# Altium schematic sheet MCU.SchDoc: MCU Schematic
size A4; Date: 25 July 2024; Author: Ibrahim Oladepo; DrawnBy: Ibrahim Oladepo; SheetNumber: 2; SheetTotal: 5
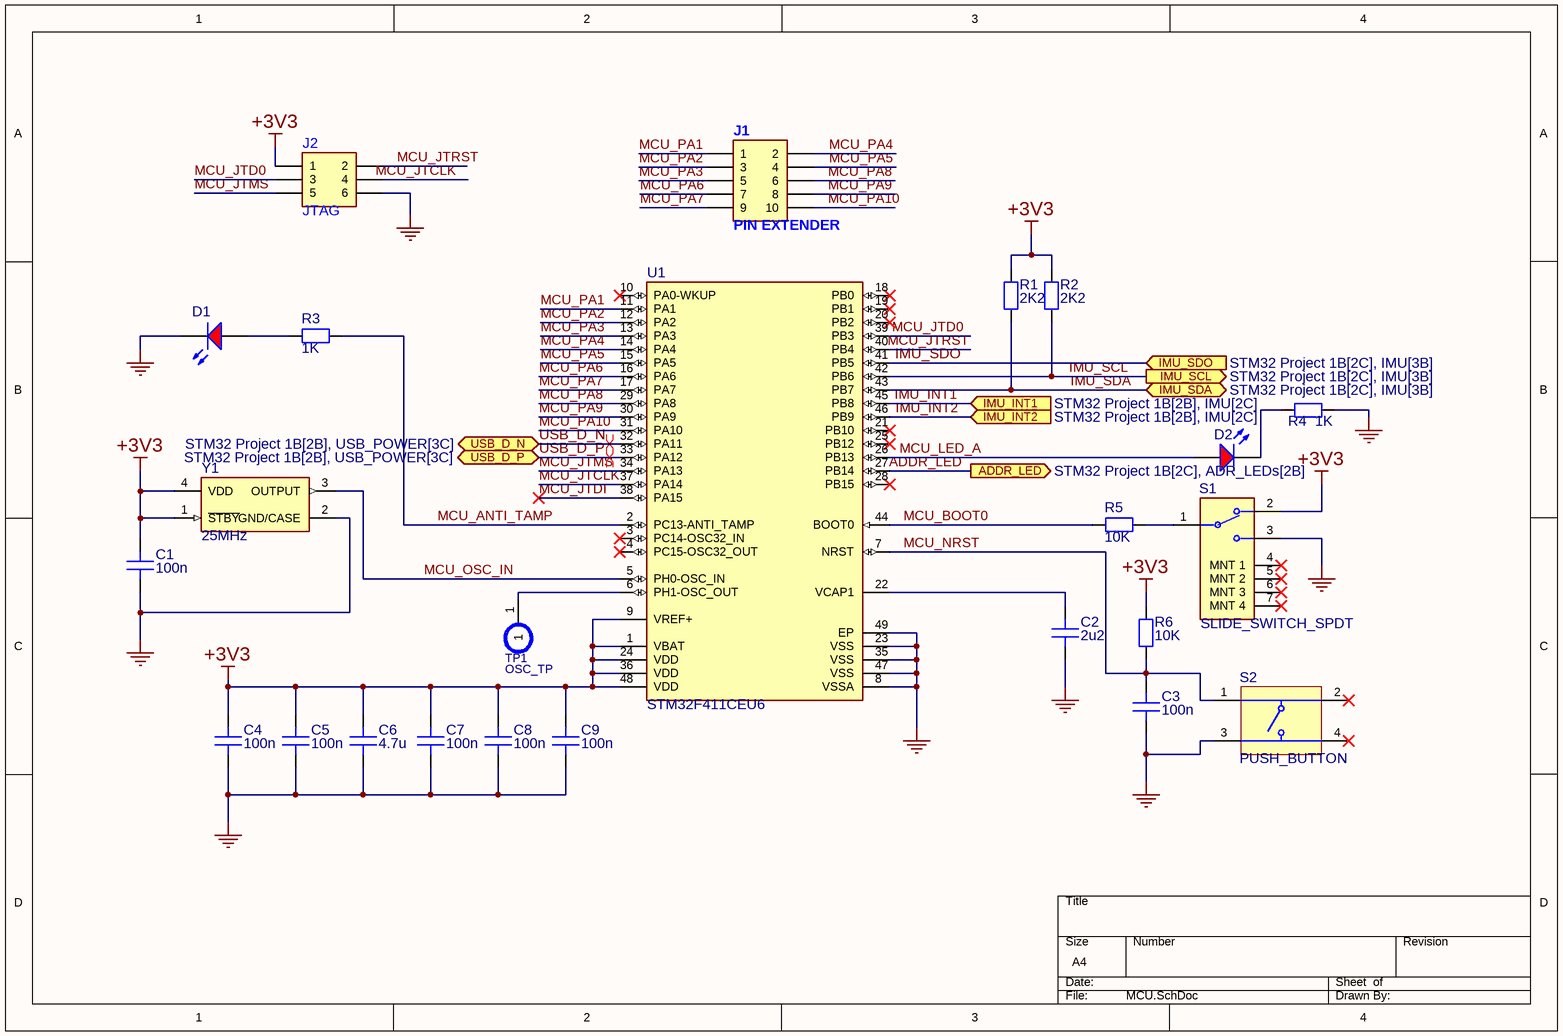
[diagram p0: MCU.SchDoc]

## Parts
C1  100n  [CAP_0805]
C2  2u2  [CAP_0805]
C3  100n  [CAP_0805]
C4  100n  [CAP_0805]
C5  100n  [CAP_0805]
C6  4.7u  [CAP_0805]
C7  100n  [CAP_0805]
C8  100n  [CAP_0805]
C9  100n  [CAP_0805]
D1  LED_RED_0805  [LED_RED_0805]  (value not drawn)
D2  LED_RED_0805  [LED_RED_0805]  (value not drawn)
J1  PIN EXTENDER  [10P_2x5_HEADER]
J2  JTAG  [6P_2x3_HEADER]
R1  2K2  [RES_0805]
R2  2K2  [RES_0805]
R3  1K  [RES_0805]
R4  1K  [RES_0805]
R5  10K  [RES_0805]
R6  10K  [RES_0805]
S1  SLIDE_SWITCH_SPDT  [SLIDE_SWITCH_SPDT]
S2  PUSH_BUTTON  [PUSH_BUTTON]
TP1  OSC_TP  [TEST_POINT_SMD]  (no BOM)
U1  STM32F411CEU6  [STM32F411CEU6]
Y1  25MHz  [XTAL_OSCILLATOR_25MHz]

## Ports
ADDR_LED (out, see STM32 Project 1B[2C], ADR_LEDs[2B]), IMU_INT1 (in, see STM32 Project 1B[2B], IMU[2C]), IMU_INT2 (in, see STM32 Project 1B[2B], IMU[2C]), IMU_SCL (out, see STM32 Project 1B[2C], IMU[3B]), IMU_SDA (bidir, see STM32 Project 1B[2C], IMU[3B]), IMU_SDO (in, see STM32 Project 1B[2C], IMU[3B]), USB_D_N (bidir, see STM32 Project 1B[2B], USB_POWER[3C]), USB_D_P (bidir, see STM32 Project 1B[2B], USB_POWER[3C])

## Nets
+3V3: C1.2 C4.2 C5.2 C6.2 C7.2 C8.2 C9.2 J2.1 R1.1 R2.1 R6.1 S1.2 U1.1(VBAT) U1.9(VREF+) U1.24(VDD) U1.36(VDD) U1.48(VDD) Y1.1(~{STBY}) Y1.4(VDD)
GND: C1.1 C2.1 C3.1 C4.1 C5.1 C6.1 C7.1 C8.1 C9.1 D1.1(K) J2.6 R4.1 S1.3 S2.3 U1.8(VSSA) U1.23(VSS) U1.35(VSS) U1.47(VSS) U1.49(EP) Y1.2(GND/CASE)
ADDR_LED: U1.27(PB14) ; port ADDR_LED
IMU_INT1: U1.45(PB8) ; port IMU_INT1
IMU_INT2: U1.46(PB9) ; port IMU_INT2
IMU_SCL: R2.2 U1.42(PB6) ; port IMU_SCL
IMU_SDA: R1.2 U1.43(PB7) ; port IMU_SDA
IMU_SDO: U1.41(PB5) ; port IMU_SDO
MCU_ANTI_TAMP: R3.1 U1.2(PC13-ANTI_TAMP)
MCU_BOOT0: R5.2 U1.44(BOOT0)
MCU_JTCLK: J2.4 U1.37(PA14)
MCU_JTD0: J2.3 U1.39(PB3)
MCU_JTDI: U1.38(PA15)
MCU_JTMS: J2.5 U1.34(PA13)
MCU_JTRST: J2.2 U1.40(PB4)
MCU_LED_A: D2.2(A) U1.26(PB13)
MCU_NRST: C3.2 R6.2 S2.1 U1.7(NRST)
MCU_OSC_IN: U1.5(PH0-OSC_IN) Y1.3(OUTPUT)
MCU_PA1: J1.1 U1.11(PA1)
MCU_PA2: J1.3 U1.12(PA2)
MCU_PA3: J1.5 U1.13(PA3)
MCU_PA4: J1.2 U1.14(PA4)
MCU_PA5: J1.4 U1.15(PA5)
MCU_PA6: J1.7 U1.16(PA6)
MCU_PA7: J1.9 U1.17(PA7)
MCU_PA8: J1.6 U1.29(PA8)
MCU_PA9: J1.8 U1.30(PA9)
MCU_PA10: J1.10 U1.31(PA10)
USB_D_N: U1.32(PA11) ; port USB_D_N
USB_D_P: U1.33(PA12) ; port USB_D_P
NetC2_2: C2.2 U1.22(VCAP1)
NetD1_2: D1.2(A) R3.2
NetD2_1: D2.1(K) R4.2
NetR5_1: R5.1 S1.1
NetTP1_1: TP1.1 U1.6(PH1-OSC_OUT)

Not connected (* = marked no-connect by the designer): S1 4(MNT_1)* 5(MNT_2)* 6(MNT_3)* 7(MNT_4)*; S2 2* 4*; U1 3(PC14-OSC32_IN)* 4(PC15-OSC32_OUT)* 10(PA0-WKUP)* 18(PB0)* 19(PB1)* 20(PB2)* 21(PB10)* 25(PB12)* 28(PB15)*

## Layout directives
differential pair: USB_D_N, USB_D_P

## Library data of the parts
C1-C9 = CAP_0805: Capacitor SMD 0805 Generic; Manufacturer: *; Manufacturer Part Number: *; Tolerance: *; Voltage Rating: *; Dielectric: *
D1 D2 = LED_RED_0805: Chip LED, Green, 2.2 V, -40 to 85 degC, 2-Pin SMD, Pb-Free, Tape and Reel; NexarPartId: 29717781; Peak Wavelength: 630nm; Wavelength: 625nm; Viewing Angle: 140°; Test Current: 20mA; Forward Voltage: 2V; Forward Current: 100mA; Lens Style: Clear, Rectangular; Color: Red; Luminous Intensity: 150mcd; Max Reverse Voltage (DC): 5V; Length: 2mm; Case Code (Imperial): 0805; RoHS: Compliant; Max Operating Temperature: 85°C; Height: 700µm; Packaging: Tape and Reel; Case/Package: 0805; REACH SVHC: Unknown; Dominant Wavelength: 625nm; Min Operating Temperature: -40°C; Case Code (Metric): 2012; Mount: Surface Mount; Width: 1.25mm
J1 = 10P_2x5_HEADER: 10 Position SMD Pin Header 2x5
J2 = 6P_2x3_HEADER: Male Header, Pitch 2.54 mm, 2 x 3 Position, Height 8.13 mm, -65 to 125 degC, RoHS, Tube; Max Supply Voltage: 5.5 V; Min Supply Voltage: 4.5 V; Nominal Supply Voltage: 5 V; Min Operating Temperature: -40 degC; ComponentLink1URL: http://www.te.com/; ComponentLink2Description: Datasheet; Pins: 3; Max Operating Temperature: 150 degC; PackageDescription: Male Header, Pitch 2.54 mm, 2 x 3 Position, Height 8.13 mm; Package Quantity: 3000; PackageReference: 5-146130-2; DatasheetVersion: Oct-15; ComponentLink1Description: Manufacturer URL; Radiation Hardening: No; Mount: Surface Mount; RoHSCompliant: true; Packaging: Tape and Reel; ComponentLink2URL: http://www.te.com/commerce/DocumentDelivery/DDEController?Action=showdoc&DocId=Customer+Drawing%7F146130%7FM%7Fpdf%7FEnglish%7FENG_CD_146130_M.pdf%7F5-146130-2
R1-R6 = RES_0805: Resistor SMD 0805 Generic; Manufacturer: *; Manufacturer Part Number: *; Tolerance: *; Package Size: *; Voltage Rating: *
S1 = SLIDE_SWITCH_SPDT: SWITCH SLIDE SPDT 300MA 6V; Manufacturer: *; Manufacturer Part Number: *; Max Current: 300mA; Max Voltage: 6V
S2 = PUSH_BUTTON: Micro Miniature Push Button Switch FSM JSM, 50 mA, -35 to 85 degC, 4-Pin SMD, RoHS, Tape and Reel; Manufacturer: TE Connectivity; Mechanical Life: 100000Cycles; Current Rating: 50mA; Actuator Material: Polyamide; Max Voltage Rating (DC): 12V; Capacitance: 0f; Illumination Type: Illuminated; Voltage Rating (DC): 24V; Case\/Package: SMD/SMT; Operating Force: 160gf; Contact Resistance: 100mOhm; Actuator Length: 0.055inch; Switch Travel: 0.25mm; Throw Configuration: SPST; Termination: GullWing; Contact Plating: Silver; Orientation: Straight; Mounting Technology: SurfaceMount; REACH SVHC: Unknown; Electrical Life: 100000Cycles; Package Reference: FSM4JSMATR; Max Operating Temperature: 85degC; Manufacturer URL: http://www.te.com/; Package Description: 4-Pin Surface Mount Device, Body 6 x 6 mm, Pitch 4.5 mm; Datasheet Version: Rev. V, 02/2015; Packaging: TapeandReel; Min Operating Temperature: -35degC; Mount: SurfaceMount; Contact Current Rating: 50mA; Contact Material: CopperAlloy; Package Quantity: 1200; Datasheet URL: http://www.te.com/commerce/DocumentDelivery/DDEController?Action=showdoc&DocId=Customer+Drawing%7F2-1437565-7%7FV%7Fpdf%7FEnglish%7FENG_CD_2-1437565-7_V.pdf%7F4-1437565-2; RoHSCompliant: true
TP1 = TEST_POINT_SMD: Test Point SMD Generic - for in circuit test
U1 = STM32F411CEU6: ARM Cortex-M4 32-bit MCU+FPU, 512 KB Flash, 128 KB RAM, 36 I/Os, 48-Pin UFQFPN, -40 to 85 degC, Tray; Operating Frequency(F) (Processor speed) (MHz): 100; FLASH Size (Prog) (kB): 512; Internal RAM Size (kB): 128; I/Os (High Current): 36; Supply Voltage(Vcc) min (V): 1.7; Package Reference: 48-Pin Ultra Thin Fine Pitch Quad Flat No-Lead, 7 x 7 x 0.6 mm Body, 0.5 mm Pitch, Exposed Pad; ComponentLink1Description: Manufacturer URL; ComponentLink1URL: http://www.st.com/; Packing: Tray; Package Description: UFQFPN48; Core: ARM Cortex-M4; ComponentLink2Description: Datasheet; ComponentLink2URL: http://www.st.com/st-web-ui/static/active/en/resource/technical/document/datasheet/DM00115249.pdf; DatasheetVersion: Rev. 6; Mounting Technology: Surface Mount
Y1 = XTAL_OSCILLATOR_25MHz: XTAL Oscillator 25MHz ±50ppm CMOS 3.3V 4-SMD 3.2mm x 2.5mm; Load Capacitance: 15pF; Min Supply Voltage: 3.135V; Max Supply Voltage: 3.465V; Max Supply Current: 13mA; Max Operating Temperature: 85°C; Termination: SMD/SMT; Operating Frequency: 25 MHz; Height: 0.047inch; Frequency: 25MHz; Mount: Surface Mount; Number of Pins: 4; Length: 3.2mm; Packaging: Tape and Reel; Frequency Stability: 50ppm; Series: ASE; Radiation Hardening: No; Package Quantity: 1000; Width: 2.5mm; Min Operating Temperature: -40°C; Lead Free: Lead Free; Case/Package: SMD/SMT; Depth: 2.5mm; Operating Supply Voltage: 3.3V